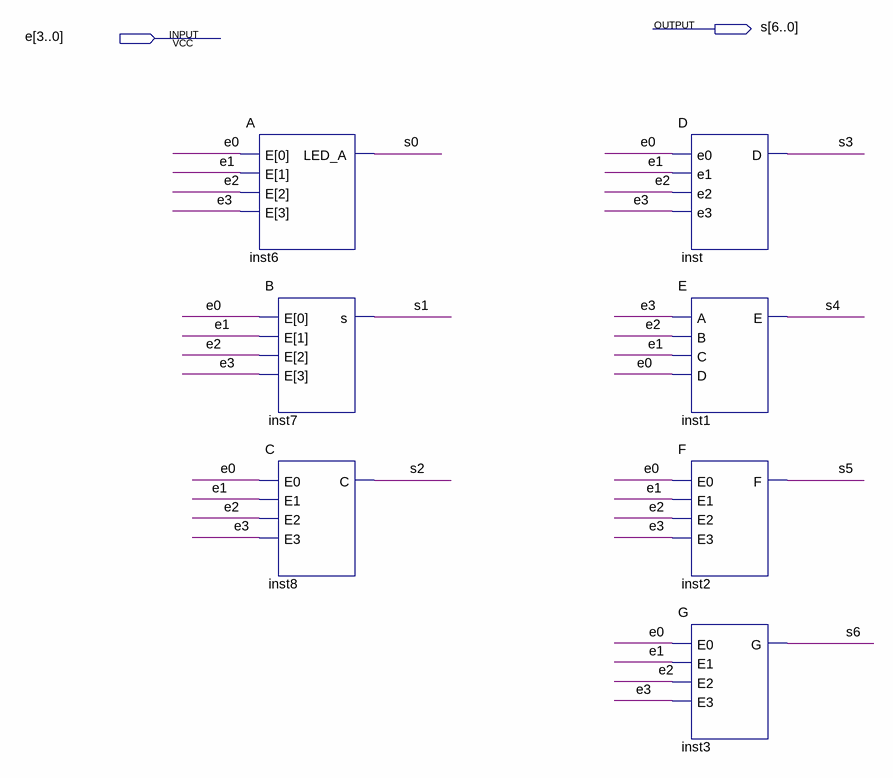
[diagram p0: schematic sheet]
// Quartus schematic display.bdf as structural Verilog: 7 symbols, 2 pins
module display (
  input  [3:0] e,
  output [6:0] s
);

  A inst6 (.E(e), .LED_A(s[0]));
  B inst7 (.E(e), .s(s[1]));
  C inst8 (.E0(e[0]), .E1(e[1]), .E2(e[2]), .E3(e[3]), .C(s[2]));
  D inst (.e0(e[0]), .e1(e[1]), .e2(e[2]), .e3(e[3]), .D(s[3]));
  E inst1 (.A(e[3]), .B(e[2]), .C(e[1]), .D(e[0]), .E(s[4]));
  F inst2 (.E0(e[0]), .E1(e[1]), .E2(e[2]), .E3(e[3]), .F(s[5]));
  G inst3 (.E0(e[0]), .E1(e[1]), .E2(e[2]), .E3(e[3]), .G(s[6]));
endmodule
